# Altium schematic sheet SoM_MT7621.SchDoc
size A1
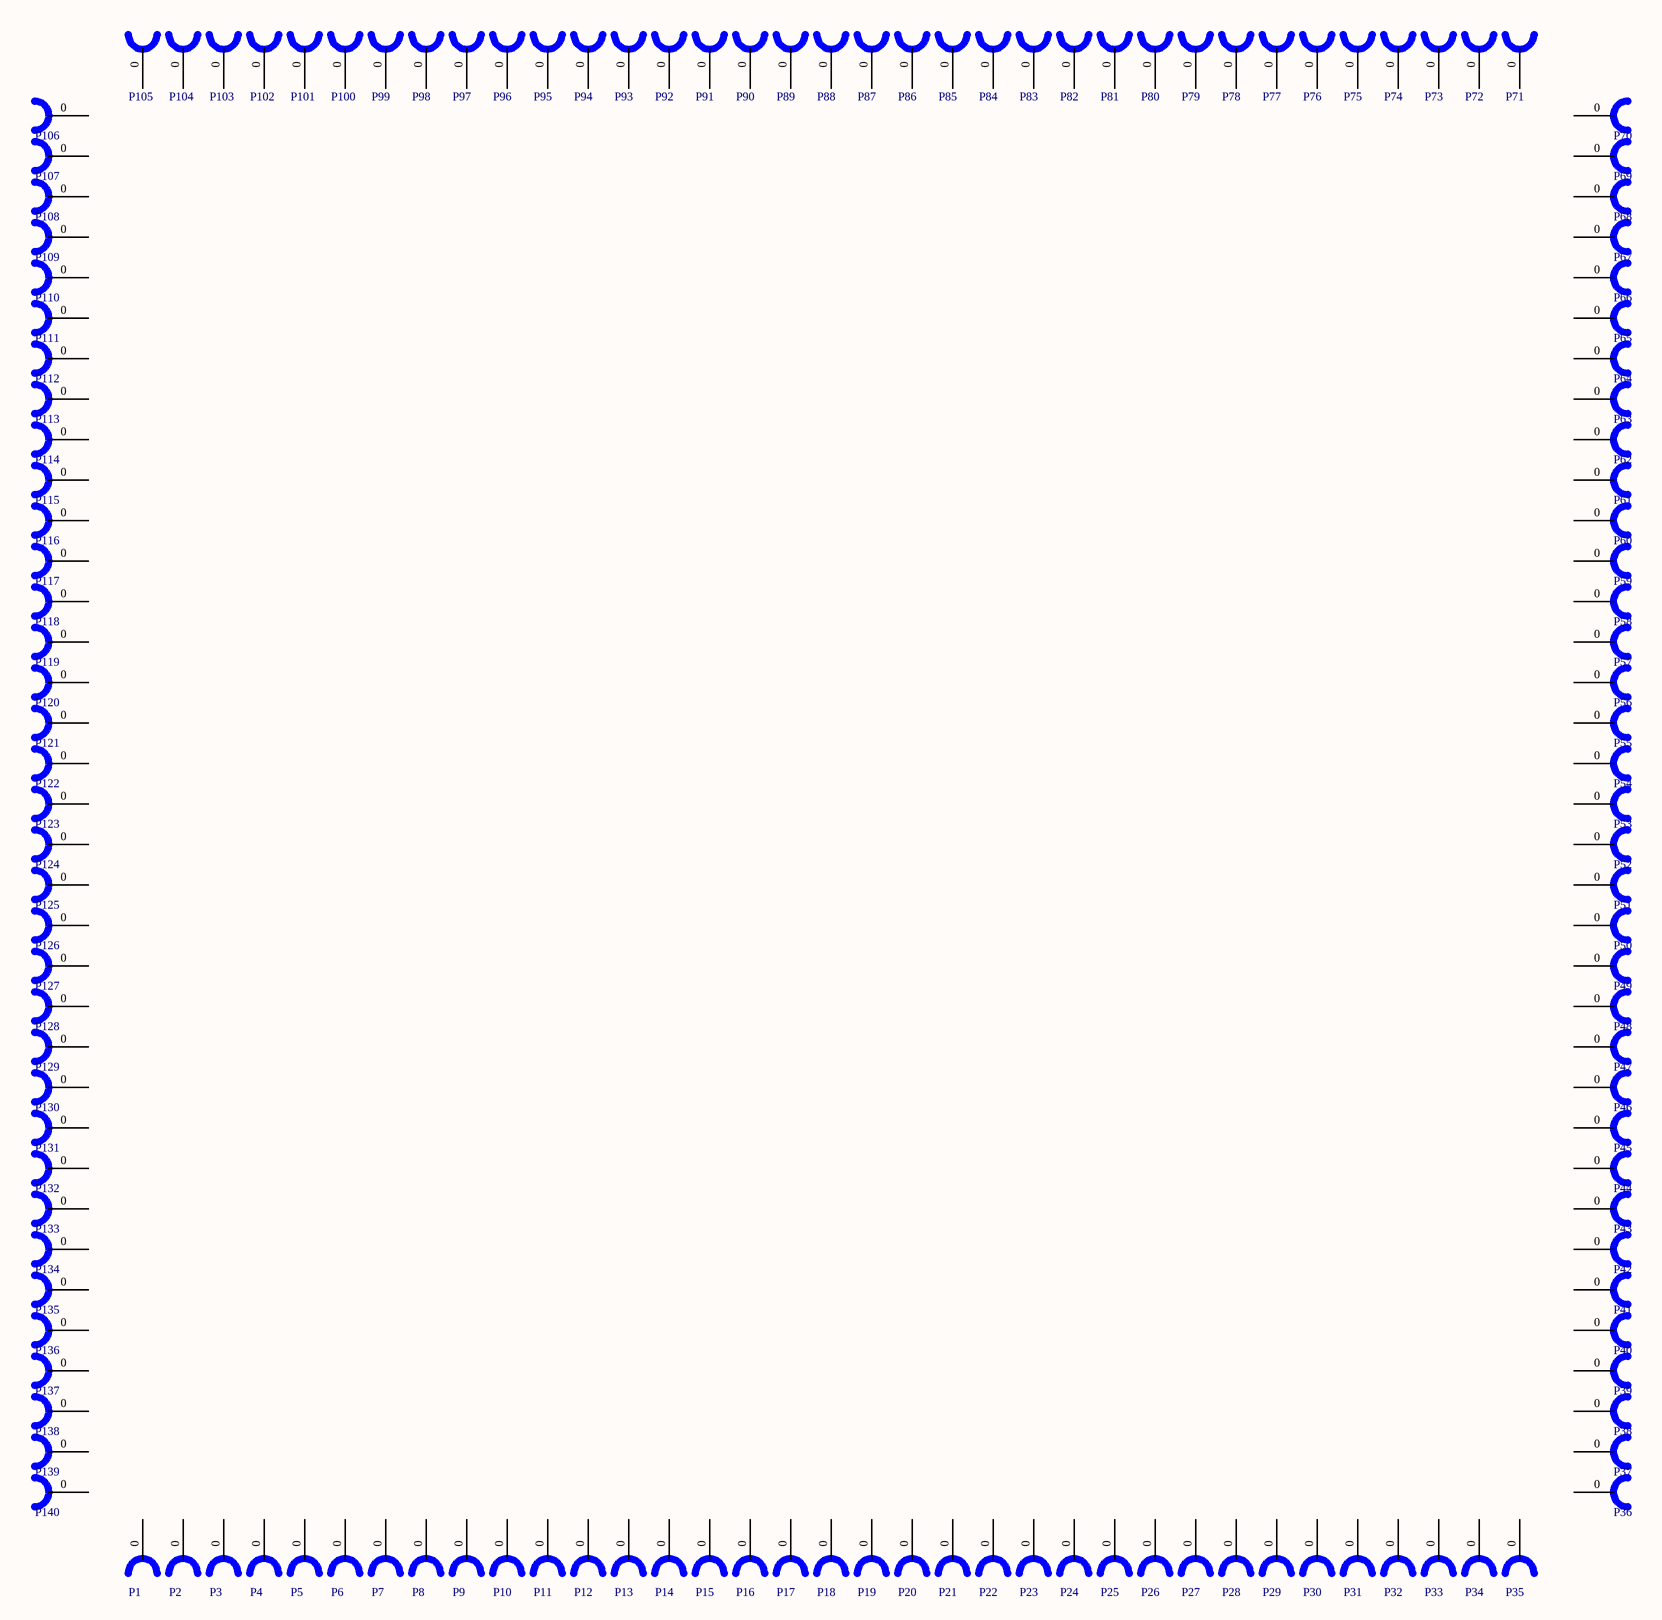
[diagram p0: SoM_MT7621.SchDoc]

## Parts
P1  Castellated Pad  [Half_Hole]  (value not drawn)
P2  Castellated Pad  [Half_Hole]  (value not drawn)
P3  Castellated Pad  [Half_Hole]  (value not drawn)
P4  Castellated Pad  [Half_Hole]  (value not drawn)
P5  Castellated Pad  [Half_Hole]  (value not drawn)
P6  Castellated Pad  [Half_Hole]  (value not drawn)
P7  Castellated Pad  [Half_Hole]  (value not drawn)
P8  Castellated Pad  [Half_Hole]  (value not drawn)
P9  Castellated Pad  [Half_Hole]  (value not drawn)
P10  Castellated Pad  [Half_Hole]  (value not drawn)
P11  Castellated Pad  [Half_Hole]  (value not drawn)
P12  Castellated Pad  [Half_Hole]  (value not drawn)
P13  Castellated Pad  [Half_Hole]  (value not drawn)
P14  Castellated Pad  [Half_Hole]  (value not drawn)
P15  Castellated Pad  [Half_Hole]  (value not drawn)
P16  Castellated Pad  [Half_Hole]  (value not drawn)
P17  Castellated Pad  [Half_Hole]  (value not drawn)
P18  Castellated Pad  [Half_Hole]  (value not drawn)
P19  Castellated Pad  [Half_Hole]  (value not drawn)
P20  Castellated Pad  [Half_Hole]  (value not drawn)
P21  Castellated Pad  [Half_Hole]  (value not drawn)
P22  Castellated Pad  [Half_Hole]  (value not drawn)
P23  Castellated Pad  [Half_Hole]  (value not drawn)
P24  Castellated Pad  [Half_Hole]  (value not drawn)
P25  Castellated Pad  [Half_Hole]  (value not drawn)
P26  Castellated Pad  [Half_Hole]  (value not drawn)
P27  Castellated Pad  [Half_Hole]  (value not drawn)
P28  Castellated Pad  [Half_Hole]  (value not drawn)
P29  Castellated Pad  [Half_Hole]  (value not drawn)
P30  Castellated Pad  [Half_Hole]  (value not drawn)
P31  Castellated Pad  [Half_Hole]  (value not drawn)
P32  Castellated Pad  [Half_Hole]  (value not drawn)
P33  Castellated Pad  [Half_Hole]  (value not drawn)
P34  Castellated Pad  [Half_Hole]  (value not drawn)
P35  Castellated Pad  [Half_Hole]  (value not drawn)
P36  Castellated Pad  [Half_Hole]  (value not drawn)
P37  Castellated Pad  [Half_Hole]  (value not drawn)
P38  Castellated Pad  [Half_Hole]  (value not drawn)
P39  Castellated Pad  [Half_Hole]  (value not drawn)
P40  Castellated Pad  [Half_Hole]  (value not drawn)
P41  Castellated Pad  [Half_Hole]  (value not drawn)
P42  Castellated Pad  [Half_Hole]  (value not drawn)
P43  Castellated Pad  [Half_Hole]  (value not drawn)
P44  Castellated Pad  [Half_Hole]  (value not drawn)
P45  Castellated Pad  [Half_Hole]  (value not drawn)
P46  Castellated Pad  [Half_Hole]  (value not drawn)
P47  Castellated Pad  [Half_Hole]  (value not drawn)
P48  Castellated Pad  [Half_Hole]  (value not drawn)
P49  Castellated Pad  [Half_Hole]  (value not drawn)
P50  Castellated Pad  [Half_Hole]  (value not drawn)
P51  Castellated Pad  [Half_Hole]  (value not drawn)
P52  Castellated Pad  [Half_Hole]  (value not drawn)
P53  Castellated Pad  [Half_Hole]  (value not drawn)
P54  Castellated Pad  [Half_Hole]  (value not drawn)
P55  Castellated Pad  [Half_Hole]  (value not drawn)
P56  Castellated Pad  [Half_Hole]  (value not drawn)
P57  Castellated Pad  [Half_Hole]  (value not drawn)
P58  Castellated Pad  [Half_Hole]  (value not drawn)
P59  Castellated Pad  [Half_Hole]  (value not drawn)
P60  Castellated Pad  [Half_Hole]  (value not drawn)
P61  Castellated Pad  [Half_Hole]  (value not drawn)
P62  Castellated Pad  [Half_Hole]  (value not drawn)
P63  Castellated Pad  [Half_Hole]  (value not drawn)
P64  Castellated Pad  [Half_Hole]  (value not drawn)
P65  Castellated Pad  [Half_Hole]  (value not drawn)
P66  Castellated Pad  [Half_Hole]  (value not drawn)
P67  Castellated Pad  [Half_Hole]  (value not drawn)
P68  Castellated Pad  [Half_Hole]  (value not drawn)
P69  Castellated Pad  [Half_Hole]  (value not drawn)
P70  Castellated Pad  [Half_Hole]  (value not drawn)
P71  Castellated Pad  [Half_Hole]  (value not drawn)
P72  Castellated Pad  [Half_Hole]  (value not drawn)
P73  Castellated Pad  [Half_Hole]  (value not drawn)
P74  Castellated Pad  [Half_Hole]  (value not drawn)
P75  Castellated Pad  [Half_Hole]  (value not drawn)
P76  Castellated Pad  [Half_Hole]  (value not drawn)
P77  Castellated Pad  [Half_Hole]  (value not drawn)
P78  Castellated Pad  [Half_Hole]  (value not drawn)
P79  Castellated Pad  [Half_Hole]  (value not drawn)
P80  Castellated Pad  [Half_Hole]  (value not drawn)
P81  Castellated Pad  [Half_Hole]  (value not drawn)
P82  Castellated Pad  [Half_Hole]  (value not drawn)
P83  Castellated Pad  [Half_Hole]  (value not drawn)
P84  Castellated Pad  [Half_Hole]  (value not drawn)
P85  Castellated Pad  [Half_Hole]  (value not drawn)
P86  Castellated Pad  [Half_Hole]  (value not drawn)
P87  Castellated Pad  [Half_Hole]  (value not drawn)
P88  Castellated Pad  [Half_Hole]  (value not drawn)
P89  Castellated Pad  [Half_Hole]  (value not drawn)
P90  Castellated Pad  [Half_Hole]  (value not drawn)
P91  Castellated Pad  [Half_Hole]  (value not drawn)
P92  Castellated Pad  [Half_Hole]  (value not drawn)
P93  Castellated Pad  [Half_Hole]  (value not drawn)
P94  Castellated Pad  [Half_Hole]  (value not drawn)
P95  Castellated Pad  [Half_Hole]  (value not drawn)
P96  Castellated Pad  [Half_Hole]  (value not drawn)
P97  Castellated Pad  [Half_Hole]  (value not drawn)
P98  Castellated Pad  [Half_Hole]  (value not drawn)
P99  Castellated Pad  [Half_Hole]  (value not drawn)
P100  Castellated Pad  [Half_Hole]  (value not drawn)
P101  Castellated Pad  [Half_Hole]  (value not drawn)
P102  Castellated Pad  [Half_Hole]  (value not drawn)
P103  Castellated Pad  [Half_Hole]  (value not drawn)
P104  Castellated Pad  [Half_Hole]  (value not drawn)
P105  Castellated Pad  [Half_Hole]  (value not drawn)
P106  Castellated Pad  [Half_Hole]  (value not drawn)
P107  Castellated Pad  [Half_Hole]  (value not drawn)
P108  Castellated Pad  [Half_Hole]  (value not drawn)
P109  Castellated Pad  [Half_Hole]  (value not drawn)
P110  Castellated Pad  [Half_Hole]  (value not drawn)
P111  Castellated Pad  [Half_Hole]  (value not drawn)
P112  Castellated Pad  [Half_Hole]  (value not drawn)
P113  Castellated Pad  [Half_Hole]  (value not drawn)
P114  Castellated Pad  [Half_Hole]  (value not drawn)
P115  Castellated Pad  [Half_Hole]  (value not drawn)
P116  Castellated Pad  [Half_Hole]  (value not drawn)
P117  Castellated Pad  [Half_Hole]  (value not drawn)
P118  Castellated Pad  [Half_Hole]  (value not drawn)
P119  Castellated Pad  [Half_Hole]  (value not drawn)
P120  Castellated Pad  [Half_Hole]  (value not drawn)
P121  Castellated Pad  [Half_Hole]  (value not drawn)
P122  Castellated Pad  [Half_Hole]  (value not drawn)
P123  Castellated Pad  [Half_Hole]  (value not drawn)
P124  Castellated Pad  [Half_Hole]  (value not drawn)
P125  Castellated Pad  [Half_Hole]  (value not drawn)
P126  Castellated Pad  [Half_Hole]  (value not drawn)
P127  Castellated Pad  [Half_Hole]  (value not drawn)
P128  Castellated Pad  [Half_Hole]  (value not drawn)
P129  Castellated Pad  [Half_Hole]  (value not drawn)
P130  Castellated Pad  [Half_Hole]  (value not drawn)
P131  Castellated Pad  [Half_Hole]  (value not drawn)
P132  Castellated Pad  [Half_Hole]  (value not drawn)
P133  Castellated Pad  [Half_Hole]  (value not drawn)
P134  Castellated Pad  [Half_Hole]  (value not drawn)
P135  Castellated Pad  [Half_Hole]  (value not drawn)
P136  Castellated Pad  [Half_Hole]  (value not drawn)
P137  Castellated Pad  [Half_Hole]  (value not drawn)
P138  Castellated Pad  [Half_Hole]  (value not drawn)
P139  Castellated Pad  [Half_Hole]  (value not drawn)
P140  Castellated Pad  [Half_Hole]  (value not drawn)

## Nets

Not connected (* = marked no-connect by the designer): P1 0; P2 0; P3 0; P4 0; P5 0; P6 0; P7 0; P8 0; P9 0; P10 0; P11 0; P12 0; P13 0; P14 0; P15 0; P16 0; P17 0; P18 0; P19 0; P20 0; P21 0; P22 0; P23 0; P24 0; P25 0; P26 0; P27 0; P28 0; P29 0; P30 0; P31 0; P32 0; P33 0; P34 0; P35 0; P36 0; P37 0; P38 0; P39 0; P40 0; P41 0; P42 0; P43 0; P44 0; P45 0; P46 0; P47 0; P48 0; P49 0; P50 0; P51 0; P52 0; P53 0; P54 0; P55 0; P56 0; P57 0; P58 0; P59 0; P60 0; P61 0; P62 0; P63 0; P64 0; P65 0; P66 0; P67 0; P68 0; P69 0; P70 0; P71 0; P72 0; P73 0; P74 0; P75 0; P76 0; P77 0; P78 0; P79 0; P80 0; P81 0; P82 0; P83 0; P84 0; P85 0; P86 0; P87 0; P88 0; P89 0; P90 0; P91 0; P92 0; P93 0; P94 0; P95 0; P96 0; P97 0; P98 0; P99 0; P100 0; P101 0; P102 0; P103 0; P104 0; P105 0; P106 0; P107 0; P108 0; P109 0; P110 0; P111 0; P112 0; P113 0; P114 0; P115 0; P116 0; P117 0; P118 0; P119 0; P120 0; P121 0; P122 0; P123 0; P124 0; P125 0; P126 0; P127 0; P128 0; P129 0; P130 0; P131 0; P132 0; P133 0; P134 0; P135 0; P136 0; P137 0; P138 0; P139 0; P140 0